# EAGLE design 4zollPlatine (EAGLE 9.5.2)
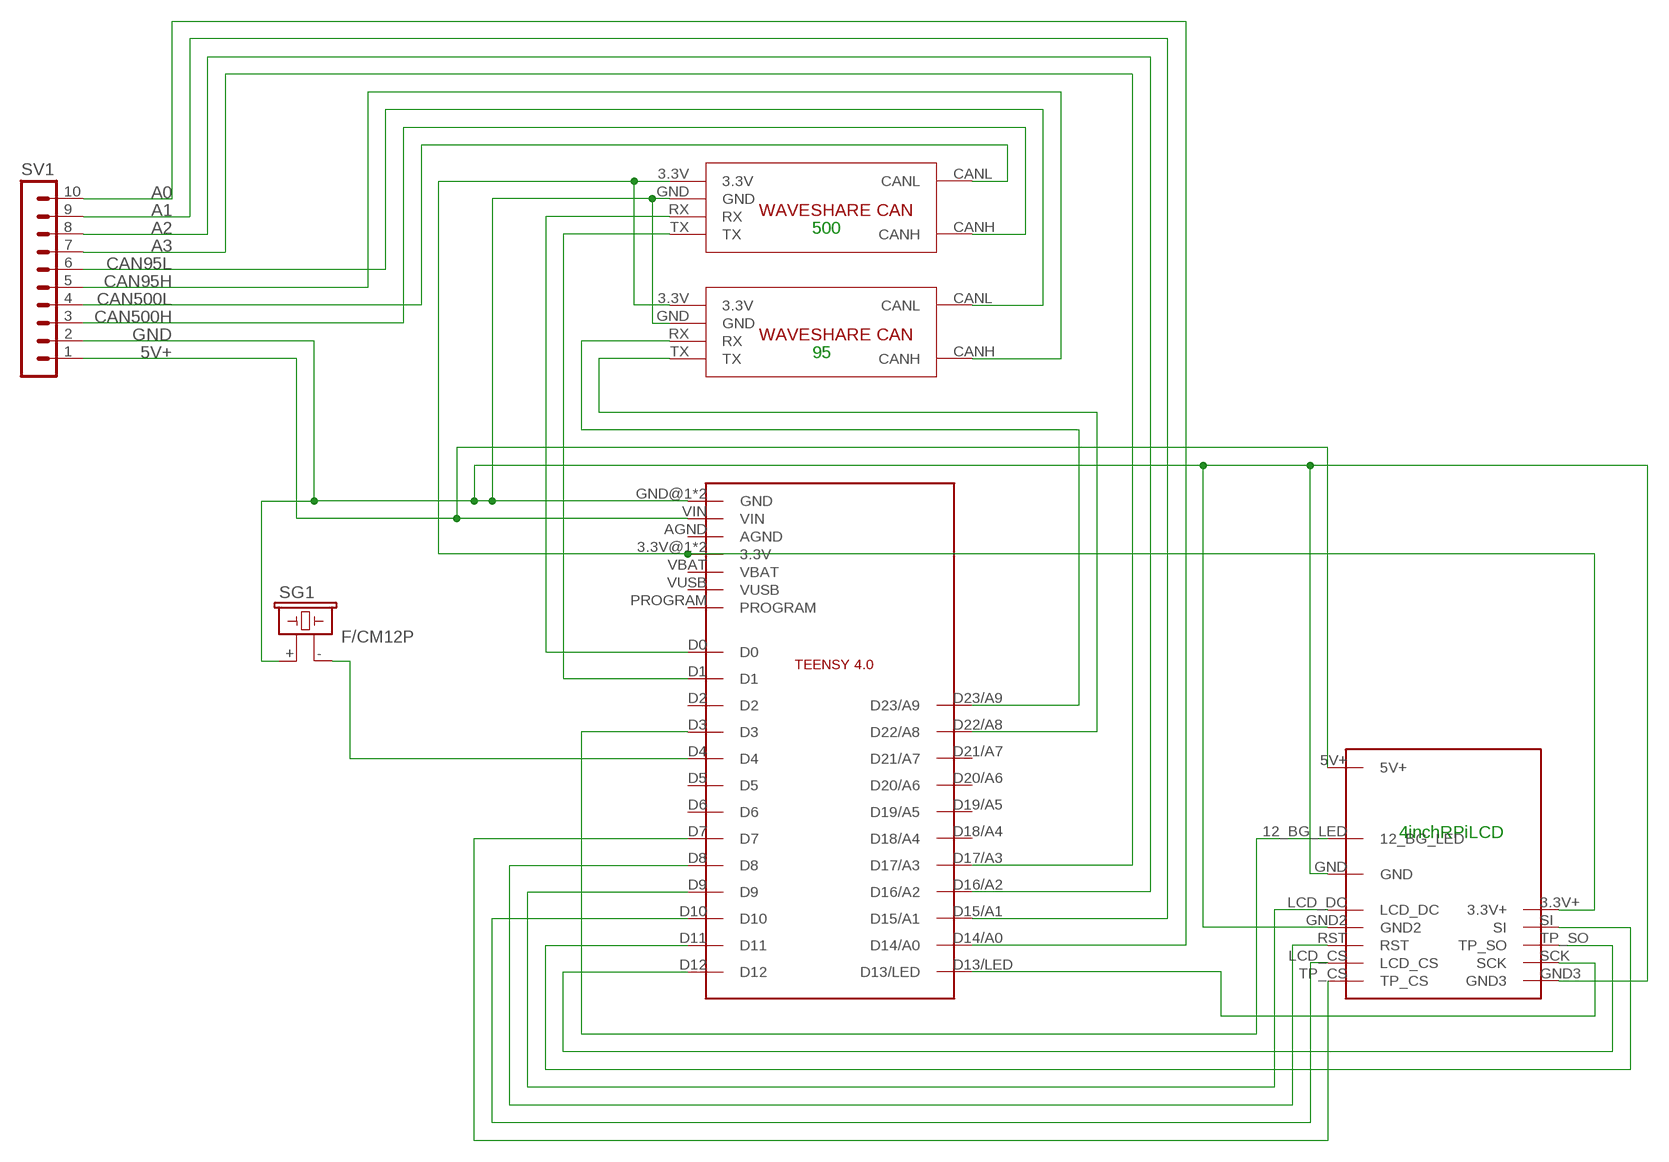
[diagram p0: schematic, sheet 1]

## Parts
95  CAN_MODULE  [CAN_BOARD]
500  CAN_MODULE  [CAN_BOARD]
SG1  F/CM12P  [F/CM12P]
SV1  MA10-1  [MA10-1]
U$1  TEENSY4.0  [TEENSY4.0]
U$2  4INCH_RPI_LCD_DEV  [4INCH_RPI_LCD_FP]

## Nets
5V+ [power]: SV1.1 U$1.VIN U$2.5V+
A0: SV1.10 U$1.D14/A0
A1: SV1.9 U$1.D15/A1
A2: SV1.8 U$1.D16/A2
A3: SV1.7 U$1.D17/A3
CAN95H: 95.CANH SV1.5
CAN95L: 95.CANL SV1.6
CAN500H: 500.CANH SV1.3
CAN500L: 500.CANL SV1.4
GND [power]: 95.GND 500.GND SG1.+ SV1.2 U$1.GND@1(GND) U$1.GND@2(GND) U$2.GND U$2.GND2 U$2.GND3
N$1: 95.3.3V 500.3.3V U$1.3.3V@1(3.3V) U$1.3.3V@2(3.3V) U$2.3.3V+
N$2: U$1.D3 U$2.12_BG_LED
N$3: SG1.- U$1.D4
N$4: U$1.D11 U$2.SI
N$7: 500.RX U$1.D0
N$8: 500.TX U$1.D1
N$9: 95.RX U$1.D23/A9
N$10: 95.TX U$1.D22/A8
N$13: U$1.D7 U$2.TP_CS
N$14: U$1.D10 U$2.LCD_CS
N$15: U$1.D8 U$2.RST
N$16: U$1.D9 U$2.LCD_DC
N$17: U$1.D13/LED U$2.SCK
N$18: U$1.D12 U$2.TP_SO
Unconnected: U$1.AGND U$1.D2 U$1.D5 U$1.D6 U$1.D18/A4 U$1.D19/A5 U$1.D20/A6 U$1.D21/A7 U$1.PROGRAM U$1.VBAT U$1.VUSB

## Notes on the sheet
- 500
- 95
- 4inchRPiLCD

## Library data of the parts
95 500 = waveshare_can:CAN_MODULE
SG1 = buzzer:F/CM12P: BUZZER Source: Buerklin; OC_FARNELL: unknown; OC_NEWARK: unknown
SV1 = con-lstb:MA10-1: PIN HEADER; OC_FARNELL: unknown; OC_NEWARK: unknown
U$1 = Teensy4.0:TEENSY4.0
U$2 = 4inchRPiLCD:4INCH_RPI_LCD_DEV

## Net classes
0 default: width 0.3 mm, drill 0.5 mm, clearance 0.2 mm
1 power: width 0.45 mm, drill 0.5 mm, clearance 0.2 mm

## Board
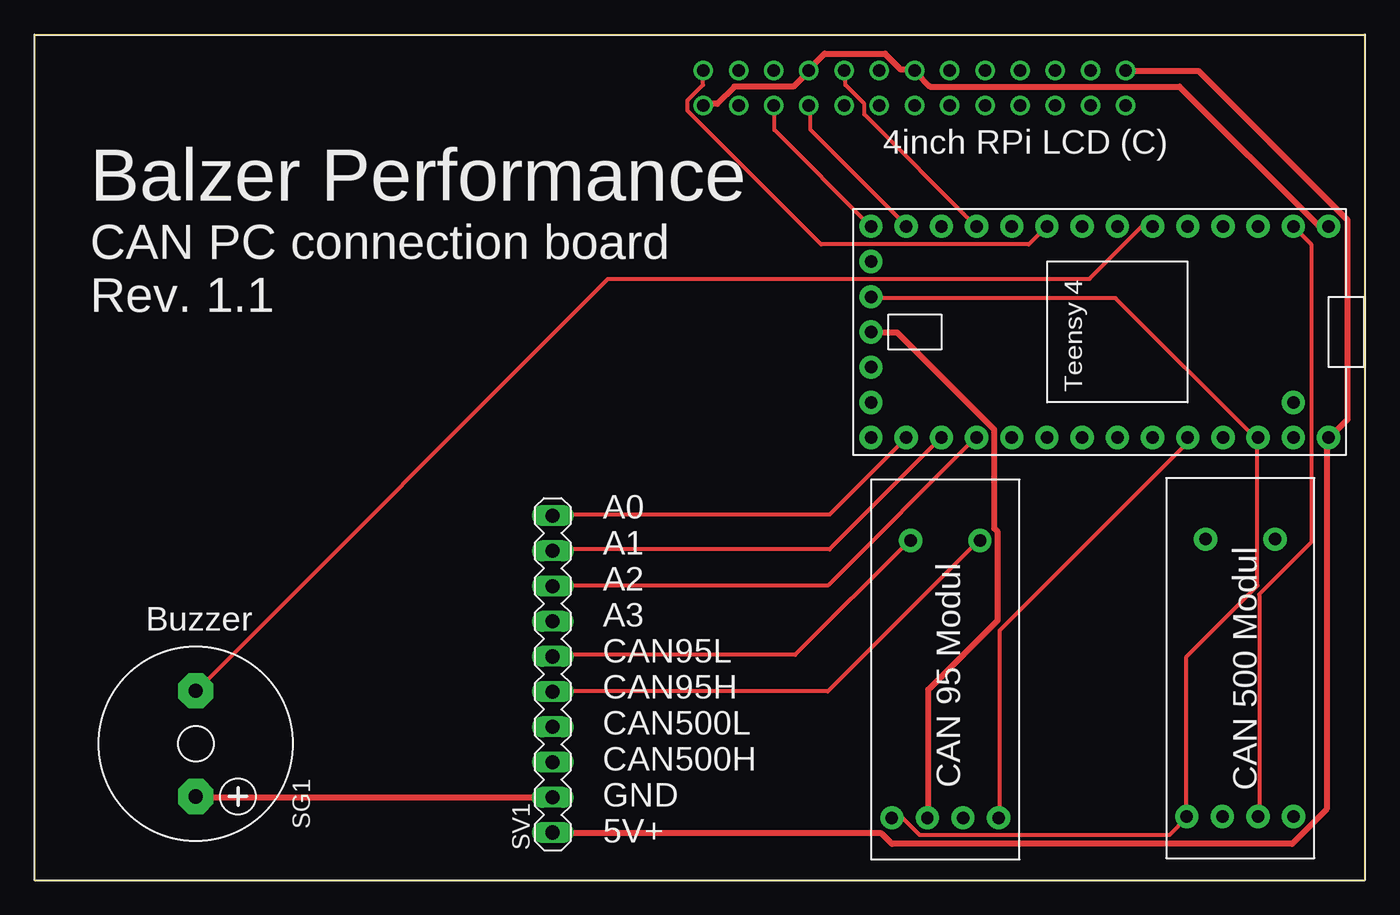
[diagram p1: board, top side]
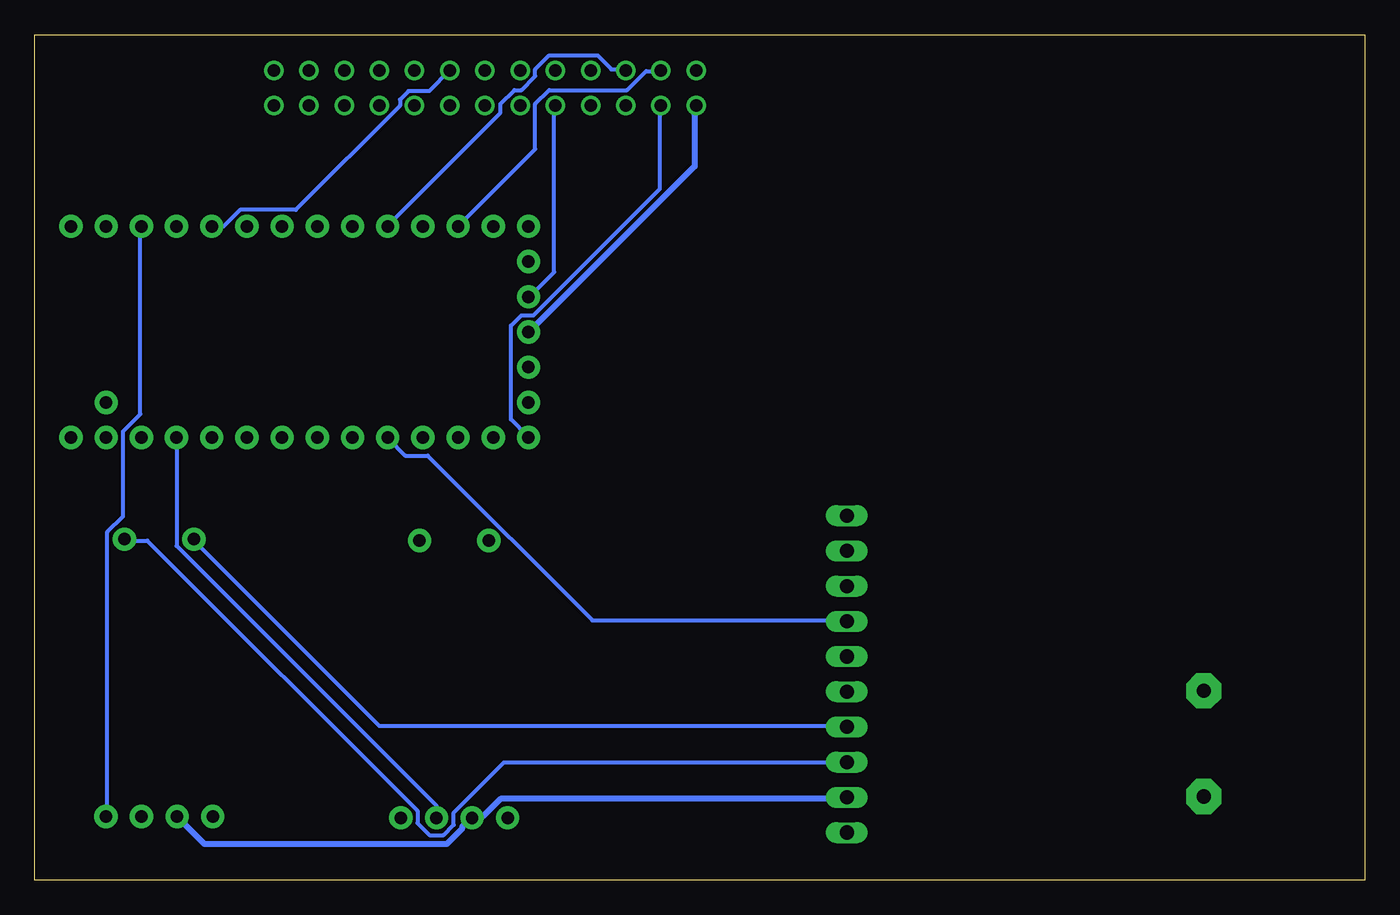
[diagram p2: board, bottom side, seen from below]

Size 96 x 61 mm. Coordinates in mm from the lower left corner, seen from the top.
Outline: 0,0 96,0 96,61 0,61 0,0
Copper layers (1*16): Top 0.035mm / dielectric 1.5mm / Bottom 0.035mm
Design rules "default": minimum track width 6mil, minimum drill 0.35mm, track to track 6mil, track to pad 6mil, pad to pad 6mil, via to via 6mil, smd to smd 6mil, copper to edge 40mil, drill to drill 6mil, minimum pad ring 10mil, minimum via ring 8mil, stop-mask expansion 4mil, vias tented up to drill 0mil, thermal gap 10mil

### Footprints (pad centres in the part's own frame; a part is rotated, then mirrored left to right if it is on the bottom)
CAN_BOARD = drill 0.9 pad 1.676: 3.3V 3,9.21; CANH 23,2.85; CANL 23,7.85; GND 3,6.64; RX 3,4.07; TX 3,1.5
F/CM12P = drill 1.016 pad 2.54 octagon: + 3.81,0; - -3.81,0
MA10-1 = drill 1.016 long: 1 -11.43,0; 2 -8.89,0; 3 -6.35,0; 4 -3.81,0; 5 -1.27,0; 6 1.27,0; 7 3.81,0; 8 6.35,0; 9 8.89,0; 10 11.43,0
TEENSY4.0 = drill 0.9 pad 1.676: 3.3V@1 7.62,10.16; 3.3V@2 -2.54,-17.78; AGND 7.62,12.7; D0 -7.62,12.7; D1 -7.62,10.16; D2 -7.62,7.62; D3 -7.62,5.08; D4 -7.62,2.54; D5 -7.62,0; D6 -7.62,-2.54; D7 -7.62,-5.08; D8 -7.62,-7.62; D9 -7.62,-10.16; D10 -7.62,-12.7; D11 -7.62,-15.24; D12 -7.62,-17.78; D13/LED 7.62,-17.78; D14/A0 7.62,-15.24; D15/A1 7.62,-12.7; D16/A2 7.62,-10.16; D17/A3 7.62,-7.62; D18/A4 7.62,-5.08; D19/A5 7.62,-2.54; D20/A6 7.62,0; D21/A7 7.62,2.54; D22/A8 7.62,5.08; D23/A9 7.62,7.62; GND@1 -7.62,15.24; GND@2 0,-17.78; ON/OFF 5.08,-17.78; PROGRAM 2.54,-17.78; VBAT -5.08,-17.78; VIN 7.62,15.24; VUSB 5.08,12.7
4INCH_RPI_LCD_FP = drill 0.9: 3.3V+ 58.42,55.88; 5V+ 78.74,58.42; 12_BG_LED 66.04,58.42; GND 63.5,58.42; GND2 55.88,58.42; GND3 48.26,55.88; LCD_CS 50.8,58.42; LCD_DC 58.42,58.42; P$6 60.96,58.42; P$9 68.58,58.42; P$10 71.12,58.42; P$11 73.66,58.42; P$12 76.2,58.42; P$14 78.74,55.88; P$15 76.2,55.88; P$16 73.66,55.88; P$17 71.12,55.88; P$18 68.58,55.88; P$19 66.04,55.88; P$20 63.5,55.88; P$21 60.96,55.88; RST 53.34,58.42; SCK 50.8,55.88; SI 55.88,55.88; TP_CS 48.26,58.42; TP_SO 53.34,55.88

### Placement (x,y rotation side)
95  71.07,1.5 90 top
500  92.36,1.6 90 top
SG1  11.63,9.85 270 top
SV1  37.39,14.87 90 top
U$1  78.14,39.55 270 top
U$2  0,0 0 top

### Tracks (layer width: path | path; a pad name or v marks a point on that pad's centre or on a via)
5V+
  Top 0.45: U$2.5V+ 78.75,58.38 84,58.38 94.75,47.62 94.75,33.25 93.5,32 U$1.VIN 93.25,31.75 93.25,5.12 90.75,2.62 61.88,2.62 61.12,3.38 37.5,3.38 SV1.1
A0
  Top 0.3: SV1.10 37.5,26.38 57.38,26.38 62.88,31.88 U$1.D14/A0
A1
  Top 0.3: SV1.9 37.5,23.88 57.38,23.88 65.38,31.88 U$1.D15/A1
A2
  Top 0.3: SV1.8 37.5,21.25 57.25,21.25 67.88,31.88 U$1.D16/A2
A3
  Bottom 0.3: SV1.7 37.5,18.75 55.75,18.75 67.62,30.62 69.25,30.62 70.5,31.88 U$1.D17/A3
CAN95H
  Top 0.3: SV1.5 37.5,13.62 57.25,13.62 68.12,24.5 95.CANH
CAN95L
  Top 0.3: SV1.6 37.5,16.25 54.88,16.25 63.12,24.5 95.CANL
CAN500H
  Bottom 0.3: SV1.3 37.5,8.5 62.12,8.5 65.75,4.88 65.75,4 66.5,3.25 67.5,3.25 68.38,4.12 68.38,5 87.88,24.5 89.5,24.5 500.CANH
CAN500L
  Bottom 0.3: SV1.4 37.5,11.12 71.12,11.12 84.5,24.5 500.CANL
GND
  Top 0.45: U$2.GND3 48.38,56 49.25,56 50.5,57.25 54.75,57.25 55.88,58.38 U$2.GND2 56,58.62 57,59.62 61.38,59.62 62.5,58.5 63.5,58.5 U$2.GND 63.62,58.25 64.62,57.25 82.62,57.25 92.62,47.25 93.38,47.25 U$1.GND@1 | SV1.2 37.38,6 11.75,6 SG1.+ | U$1.GND@2 60.38,39.5 62.25,39.5 69.25,32.5 69.25,25.38 69.5,25.12 69.5,18.75 64.5,13.75 64.5,4.5 95.GND
  Bottom 0.45: U$1.GND@2 60.25,39.62 48.38,51.5 48.38,55.88 U$2.GND3 | 500.GND 85.62,4.5 83.75,2.62 66.25,2.62 65.12,3.75 65.12,3.88 64.5,4.5 95.GND 64.25,4.62 63.62,4.62 62.38,5.88 37.5,5.88 SV1.2
N$1
  Top 0.3: 95.3.3V 62.62,4.5 63.88,3.25 81.88,3.25 83.12,4.5 500.3.3V 83.12,4.75 83.12,16.12 88.25,21.25 88.25,31.88 U$1.3.3V@1 88.12,31.88 78,42 60.38,42 U$1.3.3V@2
  Bottom 0.3: U$2.3.3V+ 58.5,55.88 58.5,43.88 60.25,42.12 U$1.3.3V@2
N$2
  Bottom 0.3: U$2.12_BG_LED 67.53,56.93 69.02,56.93 69.63,56.32 69.63,55.88 77.15,48.36 81.17,48.36 82.36,47.17 U$1.D3
N$3
  Top 0.3: U$1.D4 80.62,47.12 79.88,47.12 76.12,43.38 41.38,43.38 11.75,13.75 SG1.-
N$4
  Top 0.3: U$2.SI 56,55.88 56,54.12 62.88,47.25 U$1.D11
N$7
  Top 0.3: 500.RX 88.38,4.62 88.38,20.62 92.12,24.38 92.12,45.88 90.88,47.12 U$1.D0
N$8
  Bottom 0.3: U$1.D1 88.38,47.12 88.38,33.62 89.62,32.38 89.62,26.25 90.75,25.12 90.75,4.62 500.TX
N$9
  Bottom 0.3: 95.RX 67,5.38 85.75,24.12 85.75,31.88 U$1.D23/A9
N$10
  Top 0.3: 95.TX 69.62,4.5 69.62,18 83.12,31.5 83.12,31.88 U$1.D22/A8
N$13
  Top 0.3: U$2.TP_CS 48.25,58.38 48.25,57.38 47.12,56.25 47.12,55.5 56.75,45.88 71.75,45.88 73,47.12 U$1.D7
N$14
  Bottom 0.3: U$2.LCD_CS 50.88,58.38 51.88,58.38 53.25,57 58.88,57 59.88,56 59.88,52.75 65.38,47.25 U$1.D10
N$15
  Bottom 0.3: U$2.RST 53.38,58.5 54.38,58.5 55.38,59.5 58.88,59.5 59.88,58.5 59.88,58 60.88,57 61.38,57 62.38,56 62.38,55.38 70.5,47.25 U$1.D8
N$16
  Top 0.3: U$2.LCD_DC 58.5,58.38 58.5,57.38 59.88,56 59.88,55.25 67.88,47.25 U$1.D9
N$17
  Bottom 0.3: U$2.SCK 50.88,55.88 50.88,49.88 60,40.75 60.88,40.75 61.62,40 61.62,33.25 60.38,32 U$1.D13/LED
N$18
  Top 0.3: U$2.TP_SO 53.38,55.88 53.38,54.12 60.25,47.25 U$1.D12

### Text on the board
tPlace: 4inch RPi LCD (C) | Balzer Performance | CAN PC connection board / Rev. 1.1 | Buzzer | CAN 95 Modul | CAN 500 Modul | A0 / A1 / A2 / A3 / CAN95L / CAN95H / CAN500L / CAN500H / GND / 5V+